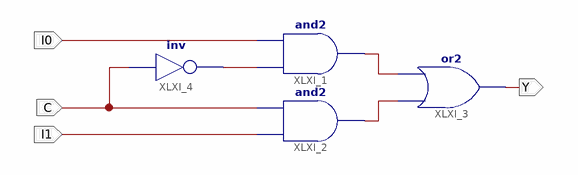
[diagram p0: schematic sheet 1]
// Xilinx ISE schematic MUX_2_to_1.sch (spartan3e) as structural Verilog: 4 symbols, 4 ports
module MUX_2_to_1 (
  input  C,
  input  I1,
  input  I0,
  output Y
);

  wire XLXN_1, XLXN_5, XLXN_6;

  and XLXI_1 (XLXN_5, XLXN_1, I0);
  and XLXI_2 (XLXN_6, I1, C);
  or XLXI_3 (Y, XLXN_6, XLXN_5);
  not XLXI_4 (XLXN_1, C);
endmodule
